# Altium schematic sheet Ethernet.SchDoc: Dual Giga-Ethernet Interfaces (PL & PS)
size A4; DocumentNumber: 9; SheetNumber: 9; SheetTotal: 16
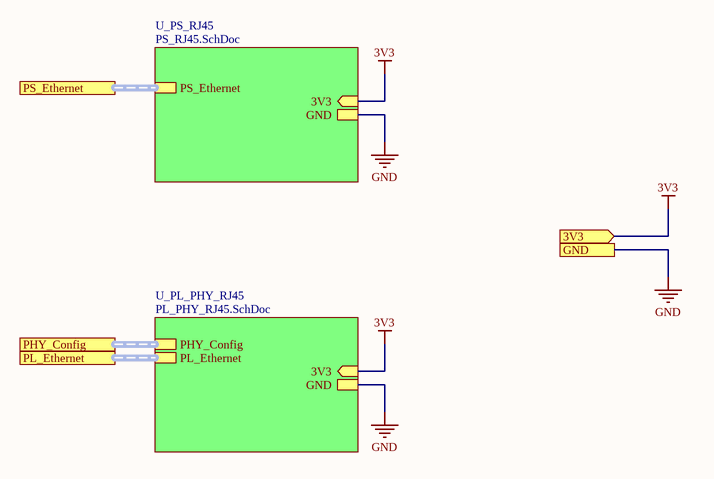
[diagram p0: Ethernet.SchDoc]

## Sub-sheets
U_PL_PHY_RJ45 = PL_PHY_RJ45.SchDoc: PL_Ethernet (harness PL Ethernet), PHY_Config (harness PHY Config), GND, 3V3 (in)
U_PS_RJ45 = PS_RJ45.SchDoc: PS_Ethernet (harness PS Ethernet), GND, 3V3 (in)

## Ports
3V3 (in), GND, PHY_Config, PL_Ethernet, PS_Ethernet

## Nets
3V3: port 3V3, sheet U_PS_RJ45/3V3, sheet U_PL_PHY_RJ45/3V3
GND: port GND, sheet U_PS_RJ45/GND, sheet U_PL_PHY_RJ45/GND

## Buses and harness runs
harness port PHY_Config = sheet U_PL_PHY_RJ45/PHY_Config
harness port PL_Ethernet = sheet U_PL_PHY_RJ45/PL_Ethernet
harness port PS_Ethernet = sheet U_PS_RJ45/PS_Ethernet

## Notes on the sheet
- Title
- FileName:
- Version:
- Date:
- Project
- Designed By:
- Descriptions:
- Sheet:
- of